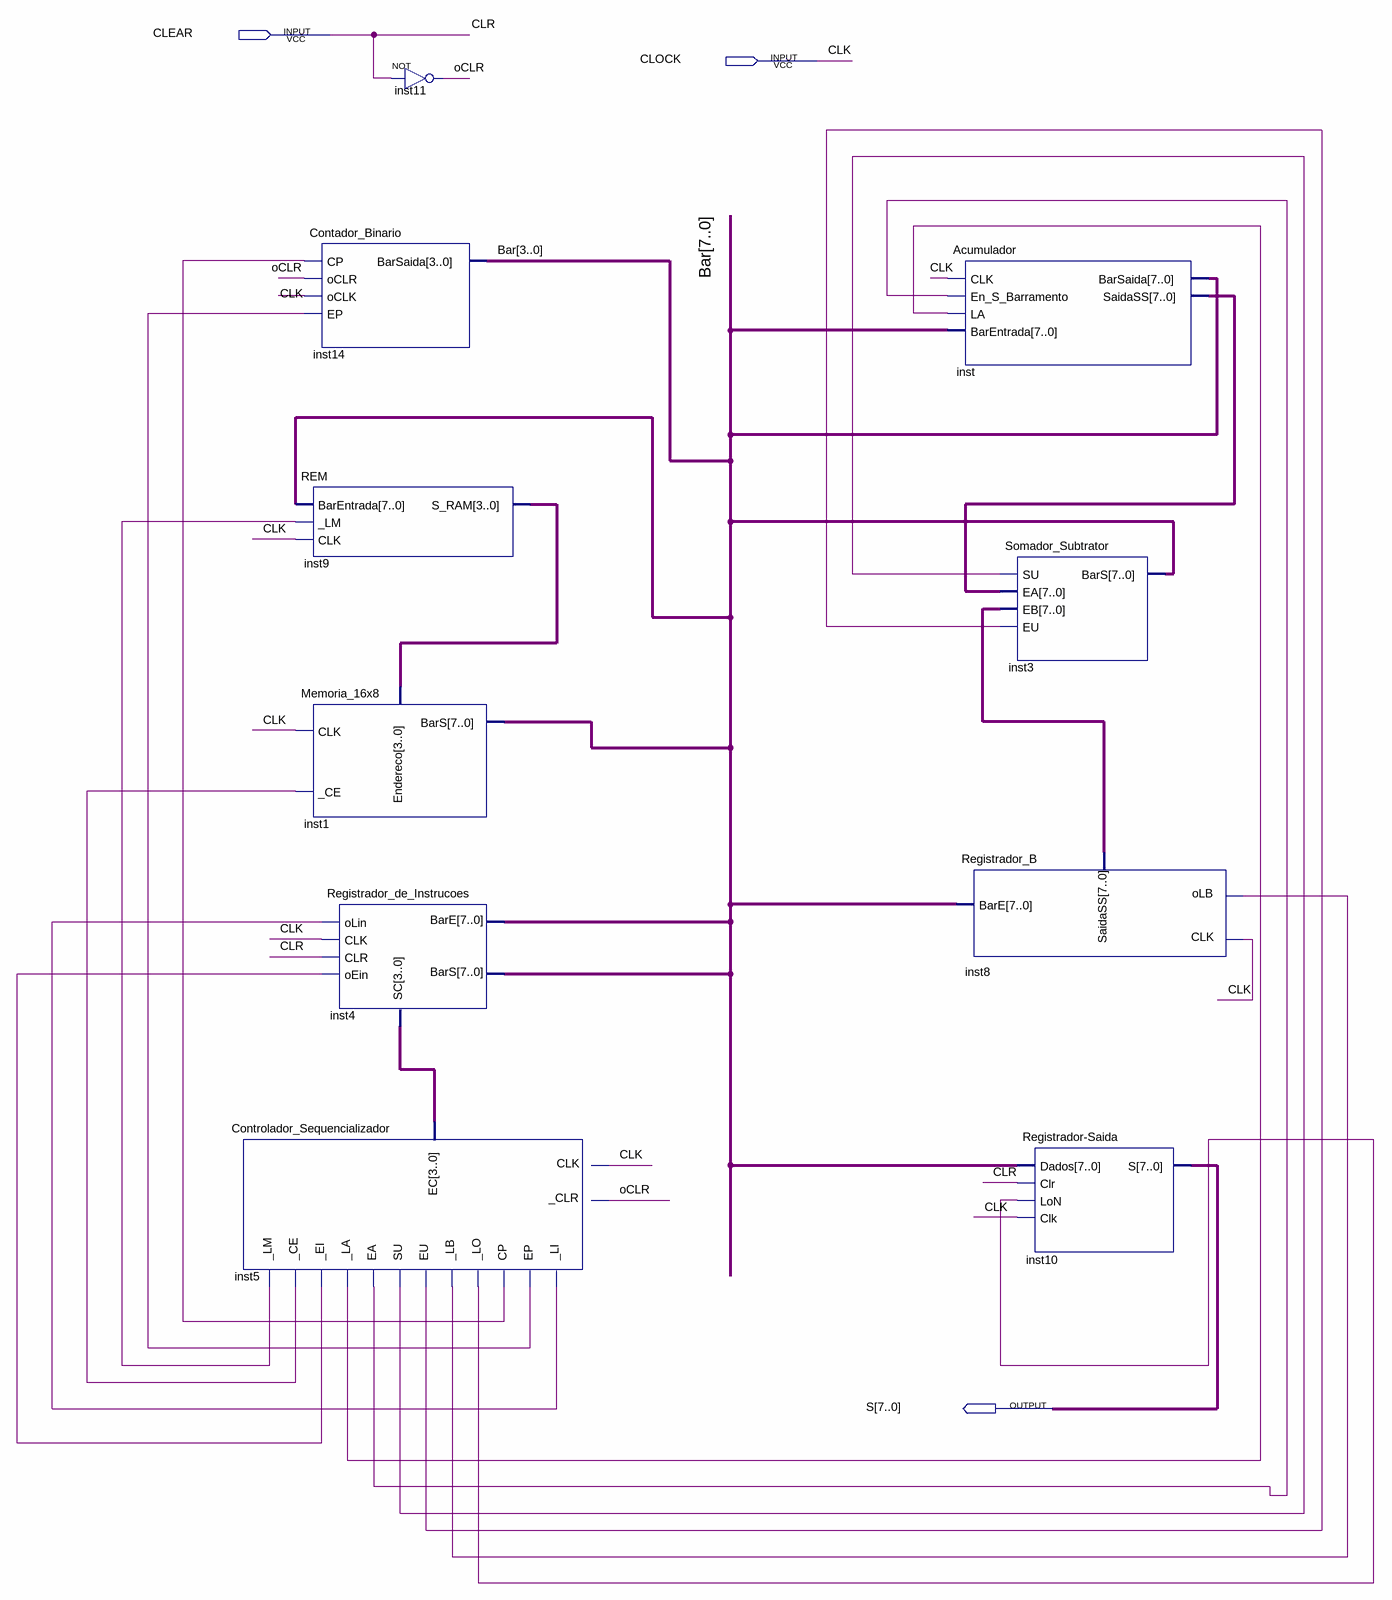
[diagram p0: schematic sheet]
// Quartus schematic Microcomputador.bdf as structural Verilog: 10 symbols, 3 pins
module Microcomputador (
  input  CLEAR,
  input  CLOCK,
  output [7:0] S
);

  wire inst5__ce, inst5__ei, inst5__la, inst5__lb, inst5__li, inst5__lm, inst5__lo, inst5_cp, inst5_ea,
       inst5_ep, inst5_eu, inst5_su, oCLR;
  wire [3:0] inst4_sc, inst9_s_ram;
  wire [7:0] Bar, inst8_saidass, inst_saidass;

  Controlador_Sequencializador inst5 (
    ._CLR(oCLR), .EC(inst4_sc), .CLK(CLOCK), ._LM(inst5__lm), ._CE(inst5__ce), ._EI(inst5__ei),
    ._LA(inst5__la), .EA(inst5_ea), .SU(inst5_su), .EU(inst5_eu), ._LB(inst5__lb), ._LO(inst5__lo),
    .CP(inst5_cp), .EP(inst5_ep), ._LI(inst5__li));
  Contador_Binario inst14 (.CP(inst5_cp), .oCLR(oCLR), .oCLK(CLOCK), .EP(inst5_ep), .BarSaida(Bar[3:0]));
  REM inst9 (.BarEntrada(Bar), ._LM(inst5__lm), .CLK(CLOCK), .S_RAM(inst9_s_ram));
  Memoria_16x8 inst1 (._CE(inst5__ce), .Endereco(inst9_s_ram), .CLK(CLOCK), .BarS(Bar));
  Registrador_de_Instrucoes inst4 (
    .BarE(Bar), .oLin(inst5__li), .CLK(CLOCK), .CLR(CLEAR), .oEin(inst5__ei), .SC(inst4_sc), .BarS(Bar));
  not inst11 (oCLR, CLEAR);
  Acumulador inst (
    .CLK(CLOCK), .En_S_Barramento(inst5_ea), .LA(inst5__la), .BarEntrada(Bar), .BarSaida(Bar),
    .SaidaSS(inst_saidass));
  Somador_Subtrator inst3 (.SU(inst5_su), .EA(inst_saidass), .EB(inst8_saidass), .EU(inst5_eu), .BarS(Bar));
  Registrador_B inst8 (.BarE(Bar), .oLB(inst5__lb), .CLK(CLOCK), .SaidaSS(inst8_saidass));
  \Registrador-Saida  inst10 (.Dados(Bar), .Clr(CLEAR), .LoN(inst5__lo), .Clk(CLOCK), .S(S));

  // Other names for the same wires on the sheet: CLR = CLEAR; CLK = CLOCK
endmodule
